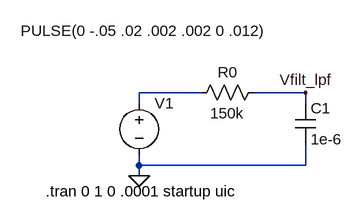
[diagram p0: schematic lpf.asc]
lpf.asc, the LTspice schematic file:
Version 4
SHEET 1 880 680
WIRE 64 80 -32 80
WIRE 224 80 144 80
WIRE -32 96 -32 80
WIRE 224 96 224 80
WIRE -32 192 -32 176
WIRE 224 192 224 160
WIRE 224 192 -32 192
WIRE -32 208 -32 192
FLAG 224 80 Vfilt_lpf
FLAG -32 208 0
SYMBOL cap 208 96 R0
SYMATTR InstName C1
SYMATTR Value 1e-6
SYMBOL voltage -32 80 R0
WINDOW 123 0 0 Left 0
WINDOW 39 0 0 Left 0
WINDOW 3 -182 -95 Left 2
SYMATTR Value PULSE(0 -.05 .02 .002 .002 0 .012)
SYMATTR InstName V1
SYMBOL res 160 64 R90
WINDOW 0 0 56 VBottom 2
WINDOW 3 32 56 VTop 2
SYMATTR InstName R0
SYMATTR Value 150k
TEXT -176 232 Left 2 !.tran 0 1 0 .0001 startup uic

The netlist it stands for:
* lpf.asc
C1 Vfilt_lpf 0 1e-6
V1 N001 0 PULSE(0 -.05 .02 .002 .002 0 .012)
R0 Vfilt_lpf N001 150k
.tran 0 1 0 .0001 startup uic
.backanno
.end